# Altium schematic sheet Si4464_sch.SchDoc
size A4; Organization1: VINCULADA AO EXÉRCITO BRASILEIRO; Organization2: FÁBRICA DE MATERIAL DE; Organization3: COMUNICAÇÕES E ELETRÔNICA; Organization0: INDÚSTRIA DE MATERIAL BÉLICO DO BRASIL; Esquematico: Esquemático
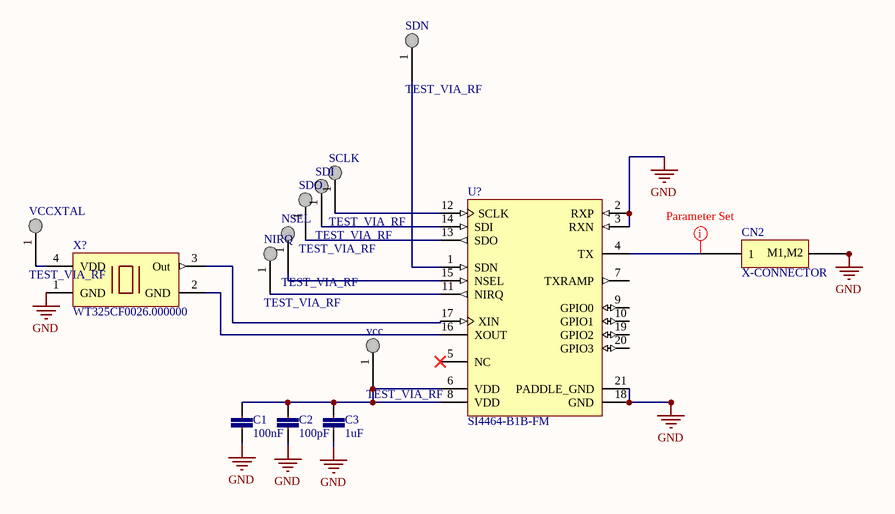
[diagram p0: Si4464_sch.SchDoc]

## Parts
C1  100nF  [0402-CAP]
C2  100pF  [0402-CAP]
C3  1uF  [0402-CAP]
CN2  X-CONNECTOR  [X-CONNECTOR-PCB]
NIRQ  TEST_VIA_RF  [New footprint 1]
NSEL  TEST_VIA_RF  [New footprint 1]
SCLK  TEST_VIA_RF  [New footprint 1]
SDI  TEST_VIA_RF  [New footprint 1]
SDN  TEST_VIA_RF  [New footprint 1]
SDO  TEST_VIA_RF  [New footprint 1]
U?  SI4464-B1B-FM  [QFN-20-2600x2600TP_N]
vcc  TEST_VIA_RF  [New footprint 1]
VCCXTAL  TEST_VIA_RF  [New footprint 1]
X?  WT325CF0026.000000  [XTAL-3.2x2.5-4P]

## Nets
GND: C1.2 C2.2 C3.2 CN2.M1 CN2.M2 U?.2(RXP) U?.3(RXN) U?.18(GND) U?.21(PADDLE_GND) X?.1(GND)
NetC1_1: C1.1 C2.1 C3.1 U?.6(VDD) U?.8(VDD) vcc.1
NetCN2_1: CN2.1 U?.4(TX)
NetNIRQ_1: NIRQ.1 U?.11(NIRQ)
NetNSEL_1: NSEL.1 U?.15(NSEL)
NetSCLK_1: SCLK.1 U?.12(SCLK)
NetSDI_1: SDI.1 U?.14(SDI)
NetSDN_1: SDN.1 U?.1(SDN)
NetSDO_1: SDO.1 U?.13(SDO)
NetU?_16: U?.16(XOUT) X?.2(GND)
NetU?_17: U?.17(XIN) X?.3(Out)
NetVCCXTAL_1: VCCXTAL.1 X?.4(VDD)

Not connected (* = marked no-connect by the designer): U? 5(NC)* 7(TXRAMP) 9(GPIO0) 10(GPIO1) 19(GPIO2) 20(GPIO3)

## Layout directives
net class 50ohm: NetCN2_1

## Notes on the sheet
- USADO EQUIP.:
- DATA:
- ENG:
- VERIF:
- HORA:
- REV:
- APROV:
- TÍTULO:
- FOLHA:
- /
- FORMATO:
- A4
- CÓDIGO:
- ESTOQUE:
- (in symbol X-CONNECTOR-5) M1,M2

## Library data of the parts
C1 = CC0402-100nF-A.12: CAP CER 0.1UF 10V 20% X5R 0402; Part No: VJ0402V104ZXQPBC; Cod EMS: 05.281.006.133; Value: 100n
C2 = CC0402-100pF-A.2: CAP CER 100PF 50V 1% NP0 0402; Part No: GRM1555C1H101FA01D; Cod EMS: 05.281.019.520; Value: 100p
C3 = CC0402-1uF-5: CAP CER 1UF 6.3V 10% X5R 0402; Part No: JMK105BJ105KV-F; Cod EMS: 05.281.019.513; Value: 1u
CN2 = X-CONNECTOR-5: CONECTOR PARA MÓDULOS X MICROWAVE; RoHS: Yes; Mount: TH
NIRQ NSEL SCLK SDI SDN SDO vcc VCCXTAL = TEST_VIA_RF-01.A.1: Test VIA for RF circuits
U? = SI4464-B1B-FM-1: TXRX ISM EZ RADIO PRO 20QFN; Cod EMS: 05.284.001.518; Part No: SI4464-B1B-FM
X? = WT325CF0026.000000-2: OSC TCXO 26MHZ 2.8V SMD; Cod EMS: 05.290.008.059; Part No: WT325CF0026.000000